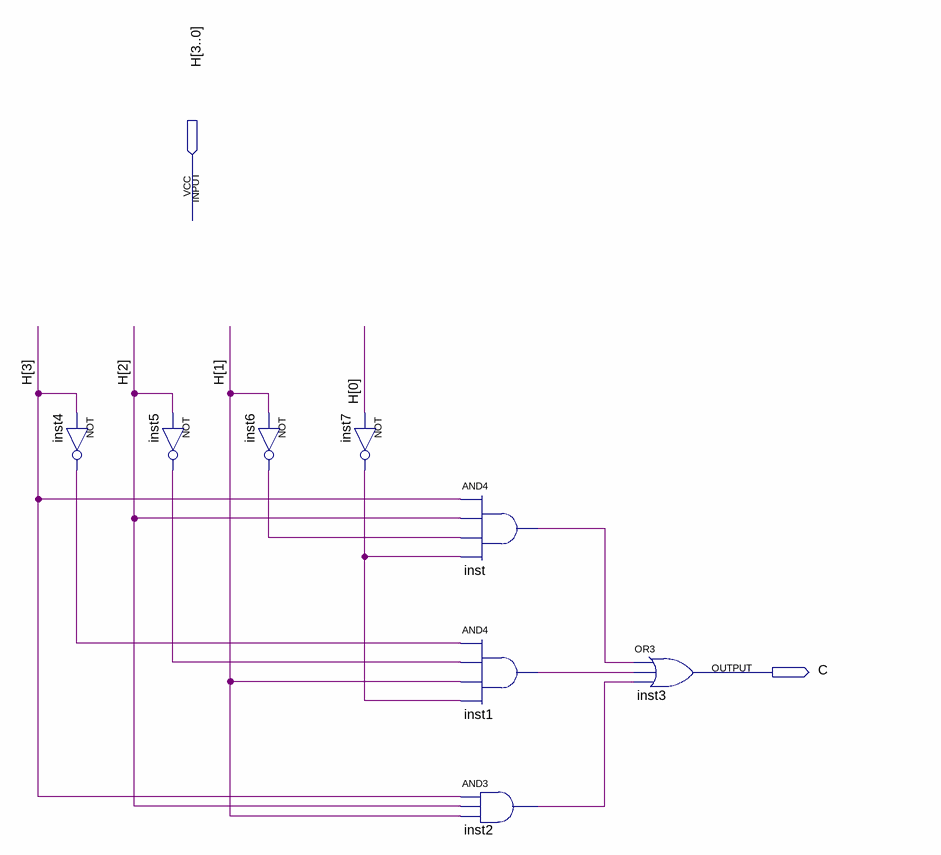
[diagram p0: schematic sheet]
// Quartus schematic C_Logic.bdf as structural Verilog: 8 symbols, 2 pins
module C_Logic (
  input  [3:0] H,
  output C
);

  wire inst1_out, inst2_out, inst4_out, inst5_out, inst6_out, inst7_out, inst_out;

  not inst4 (inst4_out, H[3]);
  not inst5 (inst5_out, H[2]);
  not inst6 (inst6_out, H[1]);
  not inst7 (inst7_out, H[0]);
  and inst (inst_out, H[3], H[2], inst6_out, inst7_out);
  and inst1 (inst1_out, inst4_out, inst5_out, H[1], inst7_out);
  and inst2 (inst2_out, H[3], H[2], H[1]);
  or inst3 (C, inst_out, inst1_out, inst2_out);
endmodule
